# Altium schematic sheet Connectors.SchDoc: CONNECTORS
size A4; Engineer: M.GUENI; Organization: Altium Limited; Address1: L3, 12a Rodborough Rd; Address2: Frenchs Forest; Address3: NSW; Address4: Australia 2086; Revision: R0; SheetNumber: 4; SheetTotal: 8
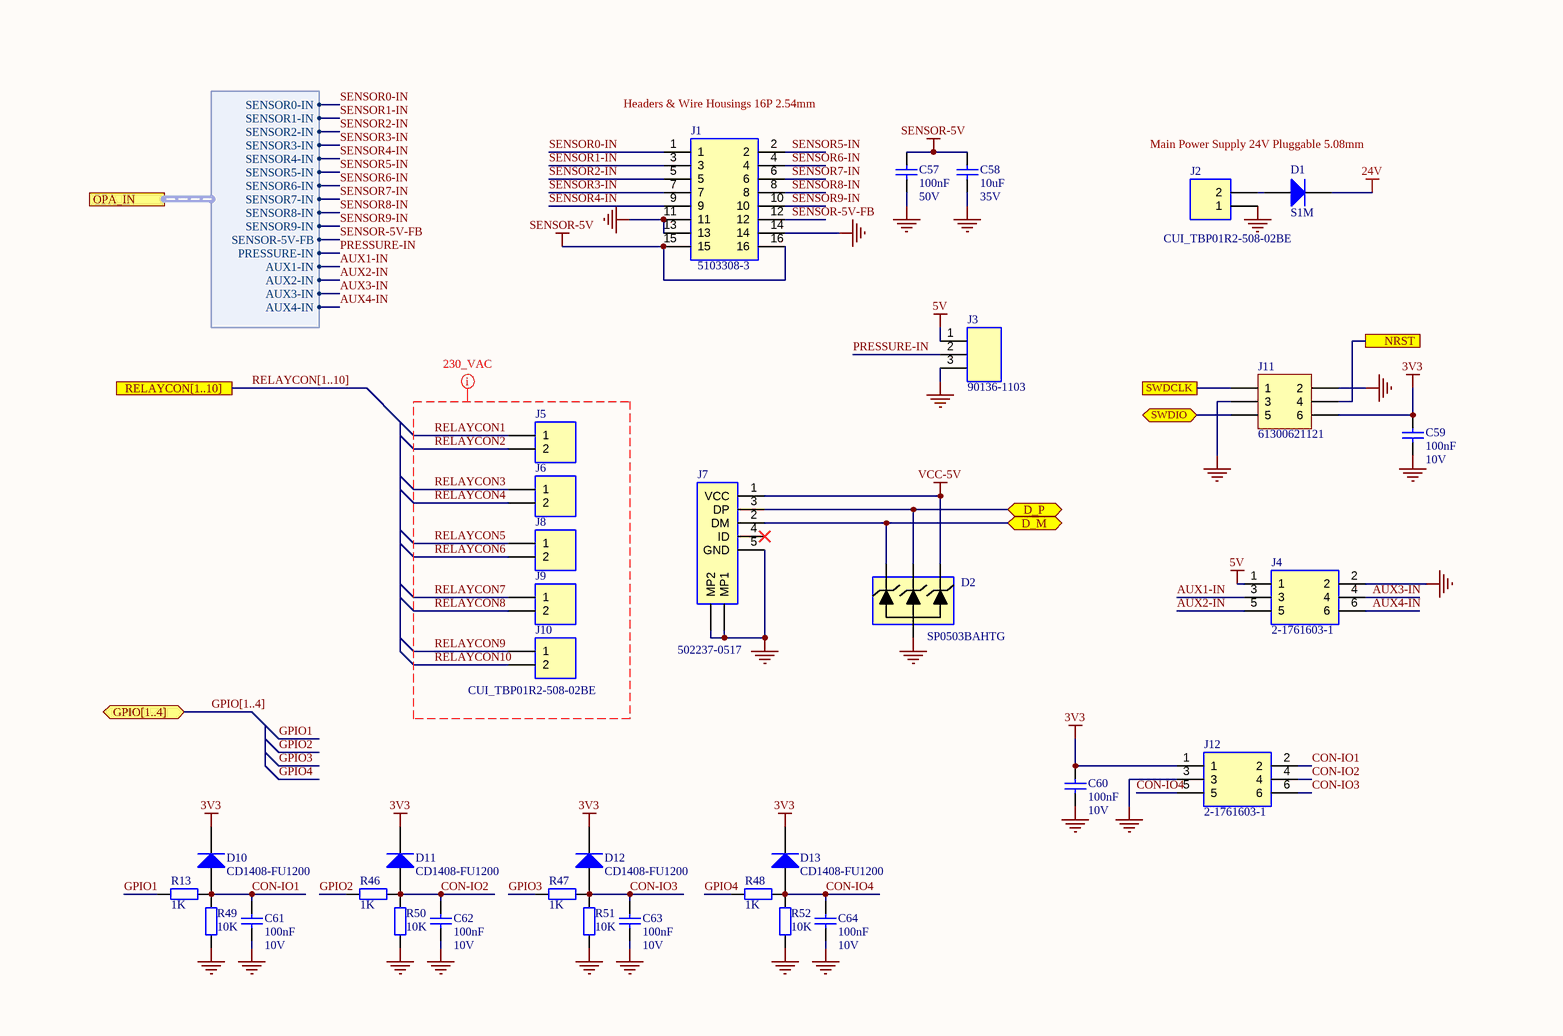
[diagram p0: Connectors.SchDoc]

## Parts
C57  Value 1: 100nF  Value 2: 50V  [CAPC1608N]  (hidden comment: Capacitor)
C58  Value 1: 10uF  Value 2: 35V  [CAPC1608N]  (hidden comment: Capacitor)
C59  Value 1: 100nF  Value 2: 10V  [CAPC1608N]  (hidden comment: Capacitor)
C60  Value 1: 100nF  Value 2: 10V  [CAPC1608N]  (hidden comment: Capacitor)
C61  Value 1: 100nF  Value 2: 10V  [CAPC1608N]  (hidden comment: Capacitor)
C62  Value 1: 100nF  Value 2: 10V  [CAPC1608N]  (hidden comment: Capacitor)
C63  Value 1: 100nF  Value 2: 10V  [CAPC1608N]  (hidden comment: Capacitor)
C64  Value 1: 100nF  Value 2: 10V  [CAPC1608N]  (hidden comment: Capacitor)
D1  S1M  [DIOM5227X270N]
D2  SP0503BAHTG  [SOT-143]
D10  CD1408-FU1200  [SOD-87]
D11  CD1408-FU1200  [SOD-87]
D12  CD1408-FU1200  [SOD-87]
D13  CD1408-FU1200  [SOD-87]
J1  5103308-3  [5103308-3]
J2  CUI_TBP01R2-508-02BE  [CUI_TBP01R2-508-02BE]
J3  90136-1103  [HDR1X3]
J4  2-1761603-1  [2-1761603-1]
J5  CUI_TBP01R2-508-02BE  [CUI_TBP01R2-508-02BE]
J6  CUI_TBP01R2-508-02BE  [CUI_TBP01R2-508-02BE]  (value not drawn)
J7  502237-0517  [502237-0517]
J8  CUI_TBP01R2-508-02BE  [CUI_TBP01R2-508-02BE]  (value not drawn)
J9  CUI_TBP01R2-508-02BE  [CUI_TBP01R2-508-02BE]  (value not drawn)
J10  CUI_TBP01R2-508-02BE  [CUI_TBP01R2-508-02BE]  (value not drawn)
J11  61300621121  [HDR2X3]
J12  2-1761603-1  [2-1761603-1]
R13  Value 1: 1K  [RESC1608N]  (hidden comment: Resistor)
R46  Value 1: 1K  [RESC1608N]  (hidden comment: Resistor)
R47  Value 1: 1K  [RESC1608N]  (hidden comment: Resistor)
R48  Value 1: 1K  [RESC1608N]  (hidden comment: Resistor)
R49  Value 1: 10K  [RESC1608N]  (hidden comment: Resistor)
R50  Value 1: 10K  [RESC1608N]  (hidden comment: Resistor)
R51  Value 1: 10K  [RESC1608N]  (hidden comment: Resistor)
R52  Value 1: 10K  [RESC1608N]  (hidden comment: Resistor)

## Ports
D_M (bidir), D_P (bidir), GPIO[1..4] (bidir), NRST, OPA_IN (harness OPA_IN), RELAYCON[1..10], SWDCLK, SWDIO (bidir)

## Harnesses
OPA_IN: SENSOR2-IN, SENSOR3-IN, SENSOR4-IN, SENSOR5-IN, SENSOR6-IN, SENSOR7-IN, SENSOR8-IN, SENSOR9-IN, SENSOR-5V-FB, PRESSURE-IN, AUX1-IN, AUX2-IN, SENSOR1-IN, AUX3-IN, SENSOR0-IN, AUX4-IN

## Nets
3V3: C59.2 C60.2 D10.1(K) D11.1(K) D12.1(K) D13.1(K) J11.6 J12.1
5V: J3.1 J4.1
24V: D1.1(K)
GND: C57.2 C58.2 C59.1 C60.1 C61.1 C62.1 C63.1 C64.1 D2.1 J1.11 J1.13 J1.14 J2.1 J3.3 J4.2 J7.5(GND) J7.MP1 J7.MP2 J11.2 J11.3 J12.3 R49.2 R50.2 R51.2 R52.2
SENSOR-5V: C57.1 C58.1 J1.15 J1.16
VCC-5V: D2.4 J7.1(VCC)
AUX1-IN: J4.3 ; port OPA_IN.AUX1-IN
AUX2-IN: J4.5 ; port OPA_IN.AUX2-IN
AUX3-IN: J4.4 ; port OPA_IN.AUX3-IN
AUX4-IN: J4.6 ; port OPA_IN.AUX4-IN
CON-IO1: C61.2 D10.2(A) J12.2 R13.1 R49.1
CON-IO2: C62.2 D11.2(A) J12.4 R46.1 R50.1
CON-IO3: C63.2 D12.2(A) J12.6 R47.1 R51.1
CON-IO4: C64.2 D13.2(A) J12.5 R48.1 R52.1
D_M: D2.2 J7.2(DM) ; port D_M
D_P: D2.3 J7.3(DP) ; port D_P
GPIO1: R13.2
GPIO2: R46.2
GPIO3: R47.2
GPIO4: R48.2
NRST: J11.4 ; port NRST
PRESSURE-IN: J3.2 ; port OPA_IN.PRESSURE-IN
RELAYCON1: J5.1
RELAYCON2: J5.2
RELAYCON3: J6.1
RELAYCON4: J6.2
RELAYCON5: J8.1
RELAYCON6: J8.2
RELAYCON7: J9.1
RELAYCON8: J9.2
RELAYCON9: J10.1
RELAYCON10: J10.2
SENSOR0-IN: J1.1 ; port OPA_IN.SENSOR0-IN
SENSOR1-IN: J1.3 ; port OPA_IN.SENSOR1-IN
SENSOR2-IN: J1.5 ; port OPA_IN.SENSOR2-IN
SENSOR3-IN: J1.7 ; port OPA_IN.SENSOR3-IN
SENSOR4-IN: J1.9 ; port OPA_IN.SENSOR4-IN
SENSOR5-IN: J1.2 ; port OPA_IN.SENSOR5-IN
SENSOR6-IN: J1.4 ; port OPA_IN.SENSOR6-IN
SENSOR7-IN: J1.6 ; port OPA_IN.SENSOR7-IN
SENSOR8-IN: J1.8 ; port OPA_IN.SENSOR8-IN
SENSOR9-IN: J1.10 ; port OPA_IN.SENSOR9-IN
SENSOR-5V-FB: J1.12 ; port OPA_IN.SENSOR-5V-FB
SWDCLK: J11.1 ; port SWDCLK
SWDIO: J11.5 ; port SWDIO
NetD1_2: D1.2(A) J2.2

Not connected (* = marked no-connect by the designer): J7 4(ID)*

## Buses and harness runs
bus GPIO[1..4] = port GPIO[1..4]
bus RELAYCON[1..10] = port RELAYCON[1..10]

## Layout directives
net class 230_VAC: RELAYCON1, RELAYCON2, RELAYCON3, RELAYCON4, RELAYCON5, RELAYCON6, RELAYCON7, RELAYCON8, RELAYCON9, RELAYCON10

## Notes on the sheet
- (near J1) Headers & Wire Housings 16P 2.54mm
- Main Power Supply 24V Pluggable 5.08mm
- THIS DOCUMENT AND THE DATA DISCLOSED HEREIN OR
- HEREWITH IS THE PROPERTY OF ALTIUM LIMITED AND MAY
- DWG NO:
- REVISION
- REV:
- DESCRIPTION
- DATE
- APPROVED
- BE FREELY DISTRIBUTED IN WHOLE. NO RIGHTS ARE
- RESERVED OR EXPRESS OR IMPLIED WARANTEE GIVEN.
- ENG:
- APPROVALS
- PROJECT
- DSN:
- CHK:
- REFERENCE DOCUMENTS
- PROJECT REVISION:
- TITLE
- DOCUMENT REVISION:
- DESIGN ITEM:
- BOM:
- FAB DWG:
- PCB DWG:
- ASSY DWG:
- SCALE:
- A3
- SIZE
- CAGE CODE
- FILE NAME
- DWG NO.
- SHEET
- OF
- REV

## Library data of the parts
C57 = CAP-000000002: MAN: VISHAY; MANREF: VJ0603V104ZXAPW1BC; DES: VJ0603V104ZXAPW1BC -  Condensateur céramique multicouche CMS, 0.1 µF, 50 V, 0603 [1608 Metric], +80%, -20%, Y5V; TOL: +80% -20%; FTP: 0603; SUP: Farnell; SUPREF: 2896408; NOTE: _; Part Number: CAP-000000002
C58 = CAP-000000006: MAN: Murata Electronics; MANREF: GRM188R6YA106MA73D; DES: Multilayer Ceramic Capacitors MLCC - SMD/SMT 0603 10uF 35volts *Derate Voltage/Temp; TOL: 20%; FTP: 0603; SUP: Mouser; SUPREF: 81-GRM188R6YA106MA3D; NOTE: _; Part Number: CAP-000000006
C59-C64 = CAP-000000005: MAN: KEMET; MANREF: C0603X104K8RACTU; DES: C0603X104K8RACTU -  Condensateur céramique multicouche CMS, 0.1 µF, 10 V, 0603 [1608 Metric], ± 10%, X7R; TOL: 10%; FTP: 0603; SUP: Farnell; SUPREF: 2904937; NOTE: _; Part Number: CAP-000000005
D1 = DIR-000000001: MAN: ON Semiconductor / Fairchild; DES: Rectifiers 1.0A 1000V; Value 1: 1A; Value 2: 1000V; TOL: _; FTP: DO-214AC; SUP: Mouser; SUPREF: 512-S1M; Part Number: DIR-000000001; MANREF: S1M; NOTE: _
D2 = TVS-000000009: MAN: Littelfuse; DES: ESD Suppressors / TVS Diodes TVS AVAL DIODE SMT; Value 1: 5.5 V; Value 2: 30 pF; TOL: _; SUP: Mouser; SUPREF: 576-SP0503BAHTG; Part Number: TVS-000000009; MANREF: SP0503BAHTG; FTP: SOT-143; NOTE: _
D10-D13 = DIR-000000003: MAN: Bourns; DES: Rectifiers RECTIFIER DIODE SMD 200VOLT; Value 1: 1A; Value 2: 200 V; TOL: _; SUP: Mouser; SUPREF: 652-CD1408-FU1200; Part Number: DIR-000000003; MANREF: CD1408-FU1200; FTP: SOD-87; NOTE: _
J1 = CON-000000002: MAN: TE Connectivity; DES: Headers & Wire Housings 16P 2 ROW HEADER LP; Value 1: 16pts; Value 2: 2.54mm; TOL: _; FTP: THT; SUP: Mouser; SUPREF: 571-5103308-3; Part Number: CON-000000002; MANREF: 5103308-3; NOTE: _
J2 J5 J6 J8-J10 = CON-000000001: MAN: CUI Devices; MANREF: TBP01R2-508-02BE / 39910-0102; DES: Pluggable Terminal Blocks Terminal block, pluggable, 5.08, receptical, 2 pole, blue; Value 1: 2pts; Value 2: 5.08 mm; TOL: _; FTP: THT; SUP: Mouser; SUPREF: 490-TBP01R2-508-02BE; Part Number: CON-000000001; NOTE: _
J3 = CON-000000004: MAN: Molex; DES: Headers & Wire Housings 2.54MM CGRIDIII HDR 3P V SR SHRD TIN; Value 1: 3pts; Value 2: 2,54 mm; TOL: _; FTP: THT; SUP: Mouser; SUPREF: 538-90136-1103; Part Number: CON-000000004; MANREF: 90136-1103; NOTE: _
J4 J12 = CON-000000003: MAN: TE Connectivity; DES: Headers & Wire Housings IDC HDR 6P VERT BLUE LOW PRO; Value 1: 6pts; Value 2: 2.54mm; FTP: THT; SUP: Mouser; SUPREF: 571-2-1761603-1; NOTE: _; Part Number: CON-000000003; MANREF: 2-1761603-1
J7 = CON-000000005: MAN: Molex; DES: USB Connectors USB Mini-B Rec Hsg Assy S/T 5Ckt; Value 1: _; FTP: THT; SUP: Mouser; SUPREF: 538-502237-0517; Part Number: CON-000000005; MANREF: 502237-0517; Value 2: _; TOL: _; NOTE: _
J11 = CON-000000006: MAN: Wurth Electronics; DES: Embases et logements de câbles WR-PHD 2.54mm Hdr 6P Dual Str Gold; Value 1: 6pts; Value 2: _; FTP: THT; SUP: Mouser; SUPREF: 710-61300621121; Part Number: CON-000000006; MANREF: 61300621121; TOL: _; NOTE: _
R13 R46-R48 = RES-000000006: MAN: TE Connectivity / Neohm; MANREF: CPF0603F1K0C1; DES: Thin Film Resistors - SMD 1KOhm .063W 50PPM; Value 2: 0.625W; TOL: 1%; FTP: 0603; SUP: Mouser; SUPREF: 279-CPF0603F1K0C1; NOTE: _; Part Number: RES-000000006
R49-R52 = RES-000000001: MAN: YAGEO; MANREF: RC0603FR-0710KL; DES: YAGEO (PHYCOMP)  RC0603FR-0710KL  RESISTANCE COUCHE EPAISSE 10K 0.1W 1%; Value 2: 0.1W; TOL: 1%; FTP: 0603; SUP: Farnell; SUPREF: 9238603; NOTE: _; Part Number: RES-000000001